# EAGLE design LipSync_Interface_Board_March_8 (EAGLE 8.5.2)
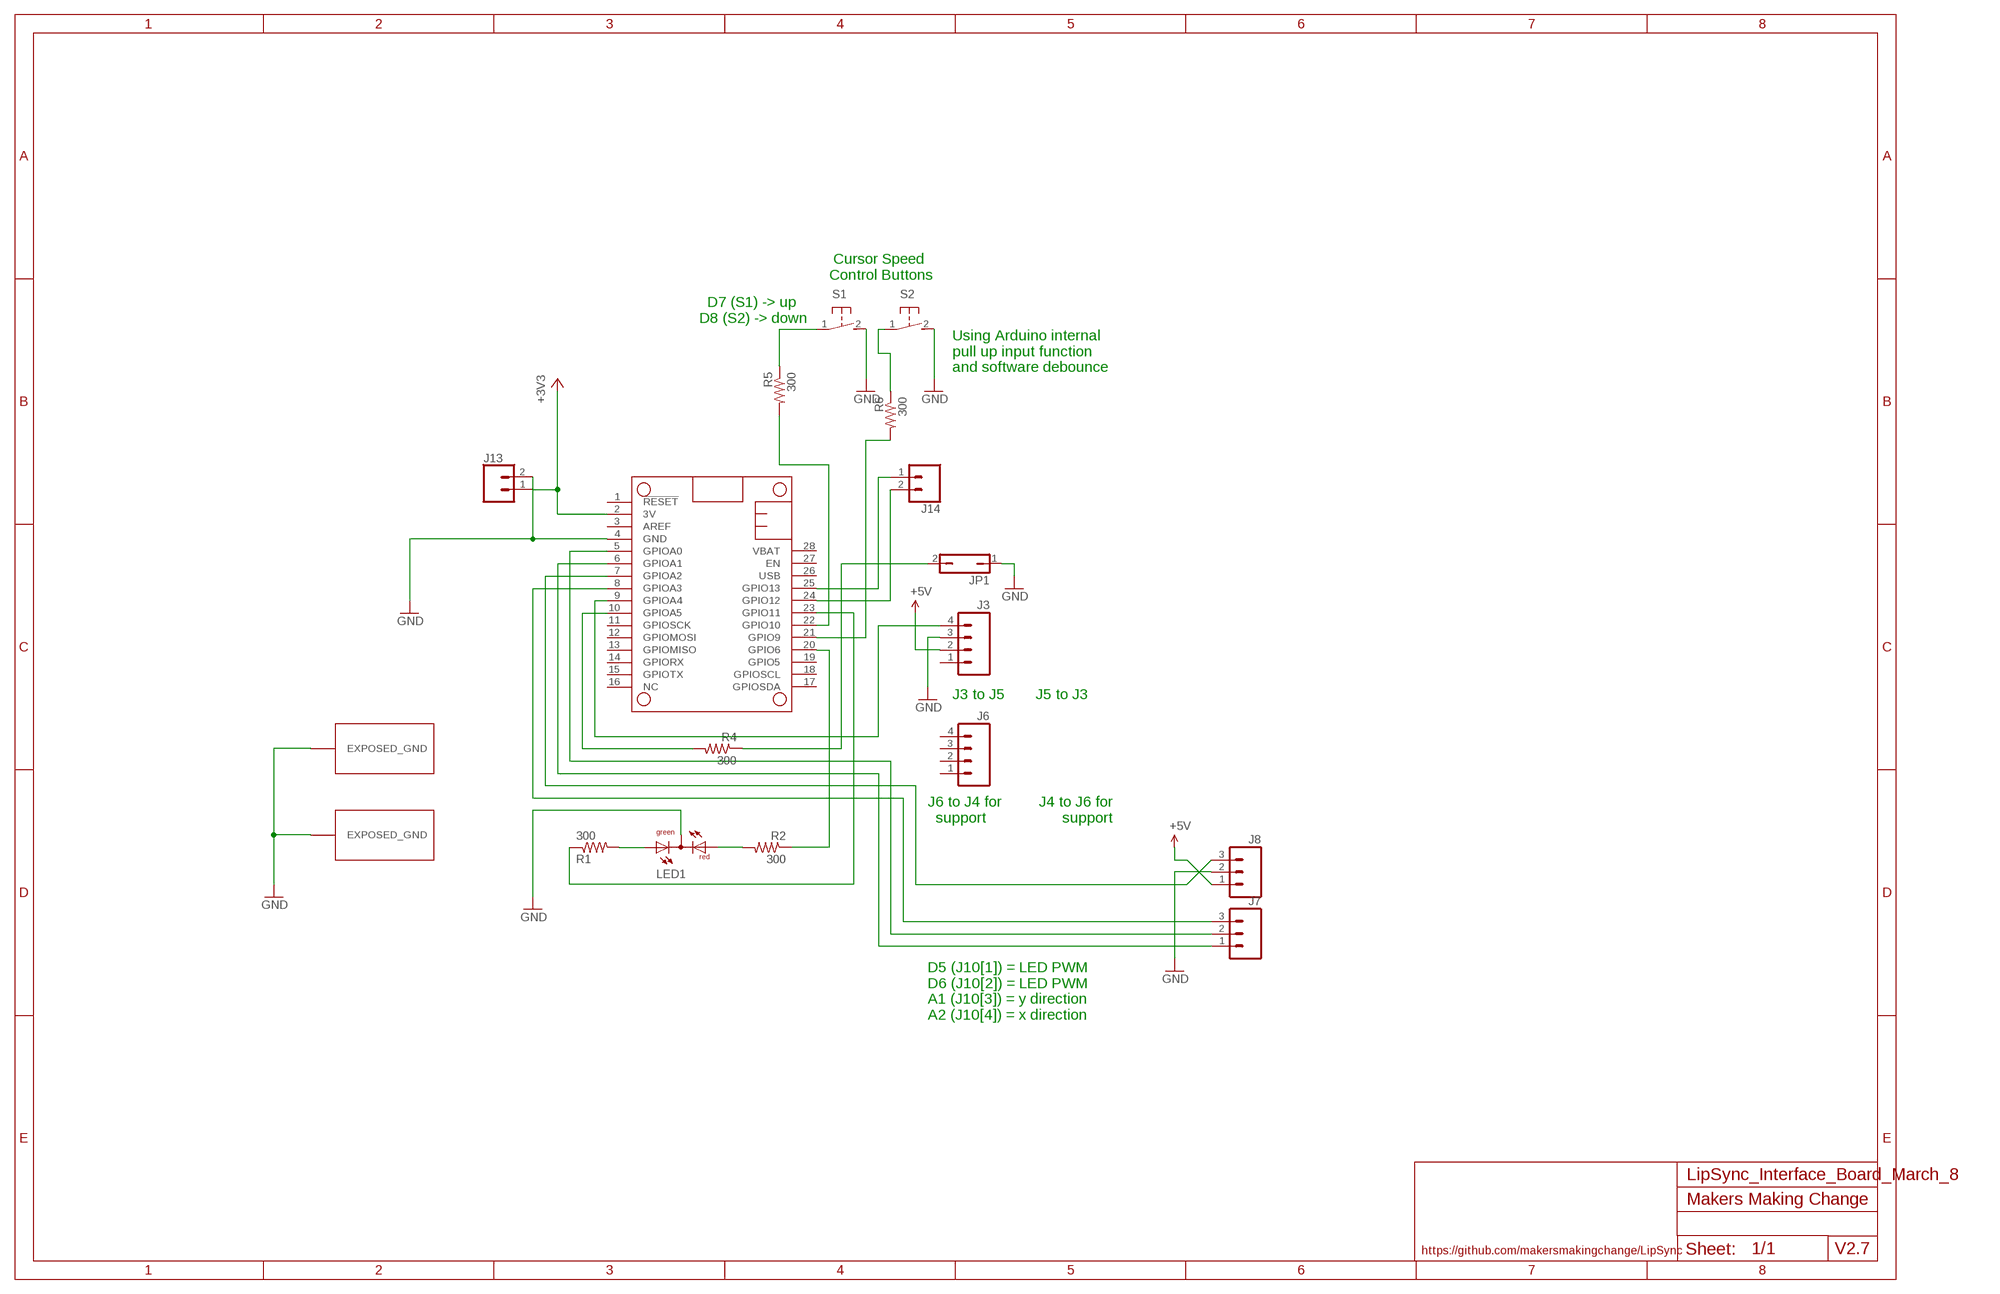
[diagram p0: schematic, sheet 1]

## Parts
J3  M04PTH  [1X04]
J6  M04PTH  [1X04]
J7  M03LOCK  [1X03_LOCK]
J8  M03LOCK  [1X03_LOCK]
J13  CONN_02  [1X02]
J14  CONN_02  [1X02]
JP1  JP1Q  [JP1]
LED1  DUOLED-RG-C  [DUOLED-C-5MM]
MS2  FEATHERWING_NODIM  [FEATHERWING_DIM]
R1  300  RESISTORAXIAL-0.3  [AXIAL-0.3]
R2  300  RESISTORAXIAL-0.3  [AXIAL-0.3]
R4  300  RESISTORAXIAL-0.3  [AXIAL-0.3]
R5  300  RESISTORAXIAL-0.3  [AXIAL-0.3]
R6  300  RESISTORAXIAL-0.3  [AXIAL-0.3]
S1  31-XXB3F-31XX-CUSTOM  [B3F-31XX-CUSTOM]
S2  31-XXB3F-31XX-CUSTOM  [B3F-31XX-CUSTOM]
U$2  EXPOSED_GND  [EXPOSED_GND]
U$3  EXPOSED_GND  [EXPOSED_GND]

## Nets
+3V3: J13.1 MS2.2(3V)
GND: J3.3 J8.2 J13.2 JP1.1 LED1.C MS2.4(GND) S1.2(S) S2.2(S) U$2.GND1(EXPOSED_GND) U$3.GND1(EXPOSED_GND)
N$1: J7.2 MS2.5(GPIOA0)
N$2: J7.1 MS2.6(GPIOA1)
N$3: J8.3 MS2.7(GPIOA2)
N$4: J7.3 MS2.8(GPIOA3)
N$5: J3.4 MS2.9(GPIOA4)
N$6: MS2.21(GPIO9) R6.P$2
N$9: MS2.20(GPIO6) R2.P$1
N$10: MS2.10(GPIOA5) R4.P$2
N$11: R5.P$1 S1.1(P)
N$12: LED1.AX(AG) R1.P$2
N$13: LED1.AR R2.P$2
N$14: JP1.2 R4.P$1
N$15: R6.P$1 S2.1(P)
N$17: J14.1 MS2.25(GPIO13)
N$18: MS2.23(GPIO11) R1.P$1
N$19: J14.2 MS2.24(GPIO12)
N$23: MS2.22(GPIO10) R5.P$2
VCC: J3.2 J8.1 ; supply symbol labelled +5V
Unconnected: J3.1 J6.1 J6.2 J6.3 J6.4 MS2.1(!RESET) MS2.3(AREF) MS2.11(GPIOSCK) MS2.12(GPIOMOSI) MS2.13(GPIOMISO) MS2.14(GPIORX) MS2.15(GPIOTX) MS2.16(NC) MS2.17(GPIOSDA) MS2.18(GPIOSCL) MS2.19(GPIO5) MS2.26(USB) MS2.27(EN) MS2.28(VBAT)

## Notes on the sheet
- Cursor Speed
  Control Buttons
- D7 (S1) -> up
  D8 (S2) -> down
- Using Arduino internal
  pull up input function
  and software debounce
- J3 to J5 | J5 to J3
- J6 to J4 for
    support
- J4 to J6 for
    support
- D5 (J10[1]) = LED PWM
  D6 (J10[2]) = LED PWM
  A1 (J10[3]) = y direction
  A2 (J10[4]) = x direction
- Makers Making Change
- https://github.com/makersmakingchange/LipSync | V2.7

## Library data of the parts
J3 J6 = SparkFun-Connectors:M04: Header 4 Standard 4-pin 0.1" header. Use with straight break away headers (SKU : PRT-00116), right angle break away headers (PRT-00553), swiss pins (PRT-00743), machine pins (PRT-00117), and female headers (PRT-00115). Molex polarized connector foot print use with SKU : PRT-08231 with associated crimp pins and housings. 1MM SMD Version SKU: PRT-10208; PROD_ID: CONN-09696
J7 J8 = SparkFun-Connectors:M03: Header 3 Standard 3-pin 0.1" header. Use with straight break away headers (SKU : PRT-00116), right angle break away headers (PRT-00553), swiss pins (PRT-00743), machine pins (PRT-00117), and female headers (PRT-00115). Molex polarized connector foot print use with SKU : PRT-08232 with associated crimp pins and housings.
J13 J14 = SparkFun-Connectors:CONN_02: Multi connection point. Often used as Generic Header-pin footprint for 0.1 inch spaced/style header connections On any of the 0.1 inch spaced packages, you can populate with these: Break Away Headers - Straight <https://www.sparkfun.com/products/116> (PRT-00116) Break Away Male Headers - Right Angle <https://www.sparkfun.com/products/553> (PRT-00553) Female Headers <https://www.sparkfun.com/products/115> (PRT-00115) Break Away Headers - Machine Pin <https://www.sparkfun.com/products/117> (PRT-00117) Break Away Female Headers - Swiss Machine Pin <https://www.sparkfun.com/products/743> (PRT-00743) For SCREWTERMINALS and SPRING TERMINALS visit here: Screw Terimnals on SparkFun.com <https://www.sparkfun.com/search/results?term=Screw+Terminals> (5mm/3.5mm/2.54mm spacing) This device is also useful as a general connection point to wire up your design to another part of your project. Our various solder wires solder well into these plated through hole pads. Hook-Up Wire - Assortment (Stranded, 22 AWG) <https://www.sparkfun.com/products/11375> (PRT-11375) Hook-Up Wire - Assortment (Solid Core, 22 AWG) <https://www.sparkfun.com/products/11367> (PRT-11367) View the entire wire category on our website here <https://www.sparkfun.com/categories/141> Special notes: Molex polarized connector foot print use with: PRT-08233 with associated crimp pins and housings. 2.54_SCREWTERM for use with PRT-10571. 3.5mm Screw Terminal footprints for PRT-08084 5mm Screw Terminal footprints for use with PRT-08432
JP1 = jumper:JP1Q: JUMPER
LED1 = led:DUOLED-RG-C: DUO LED 2 colors (red/green), 5 mm, round, common Cathode www.ligitek.com or other producers.
MS2 = adafruit:FEATHERWING
R1 R2 R4-R6 = SparkFun-Passives:RESISTOR: Resistor Basic schematic elements and footprints for 0603, 1206, and PTH resistors.
S1 S2 = switch-omron:31-XX: OMRON SWITCH
U$2 U$3 = IVAN_custom:EXPOSED_GND: Exposed copper plane to connect ground to conductive ABS housing

## Net classes
0 GND: clearance 0.205 mm
2 GND2: clearance 0.205 mm to class 0, clearance 0.205 mm to class 1, clearance 0.205 mm
3 GND3: clearance 0.205 mm to class 0, clearance 0.205 mm to class 1, clearance 0.205 mm to class 2, clearance 0.205 mm

## Board
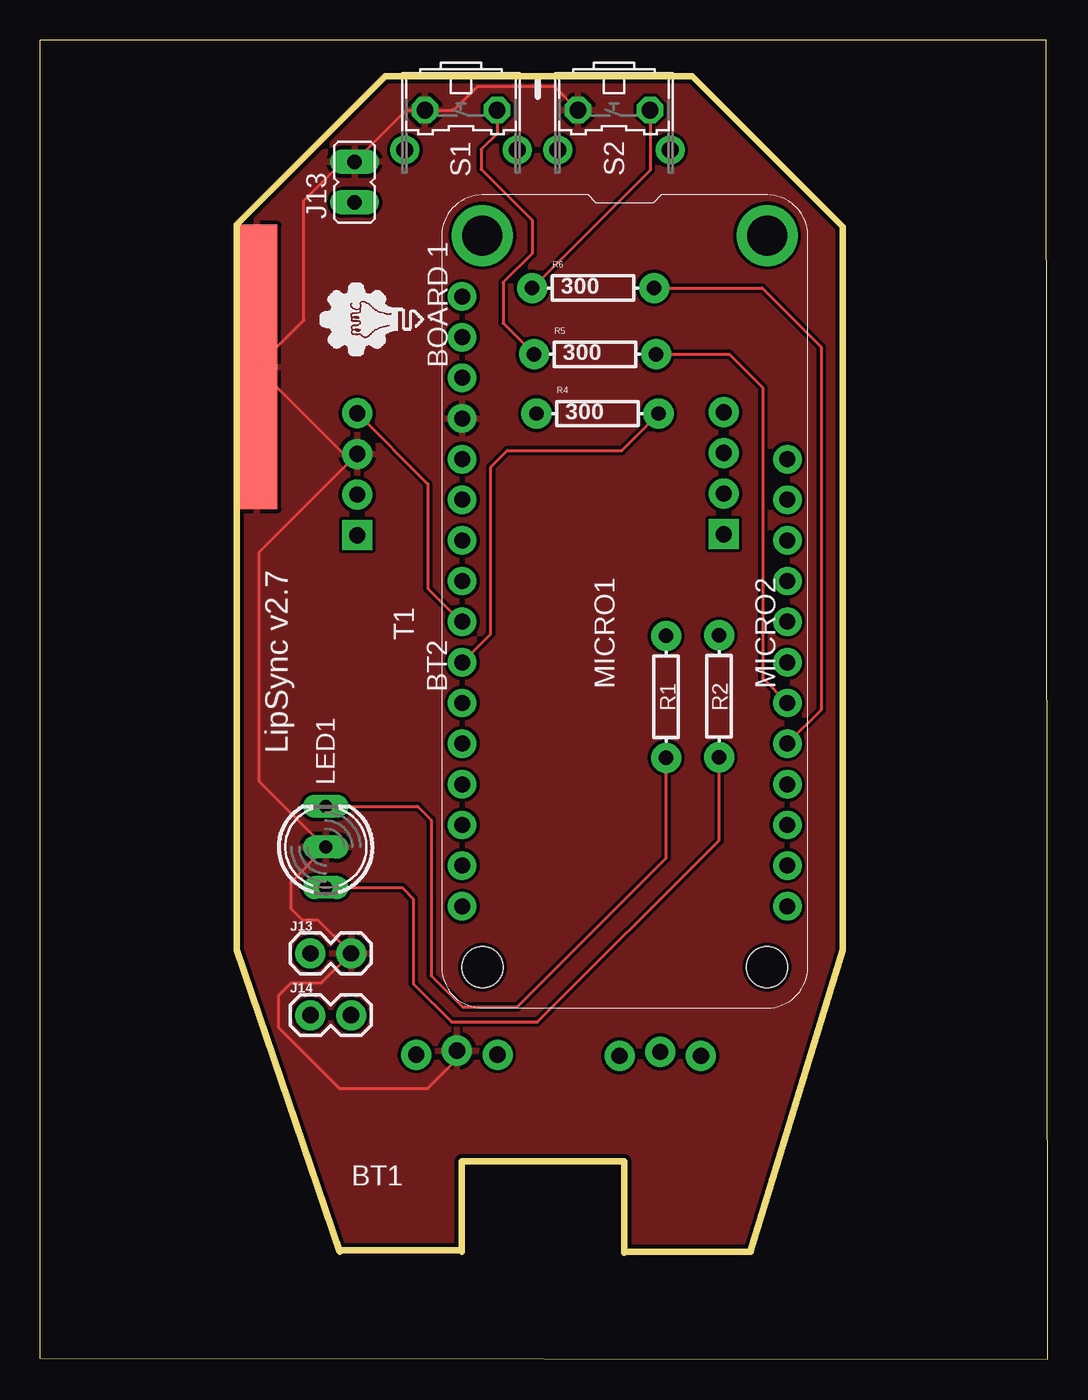
[diagram p1: board, top side]
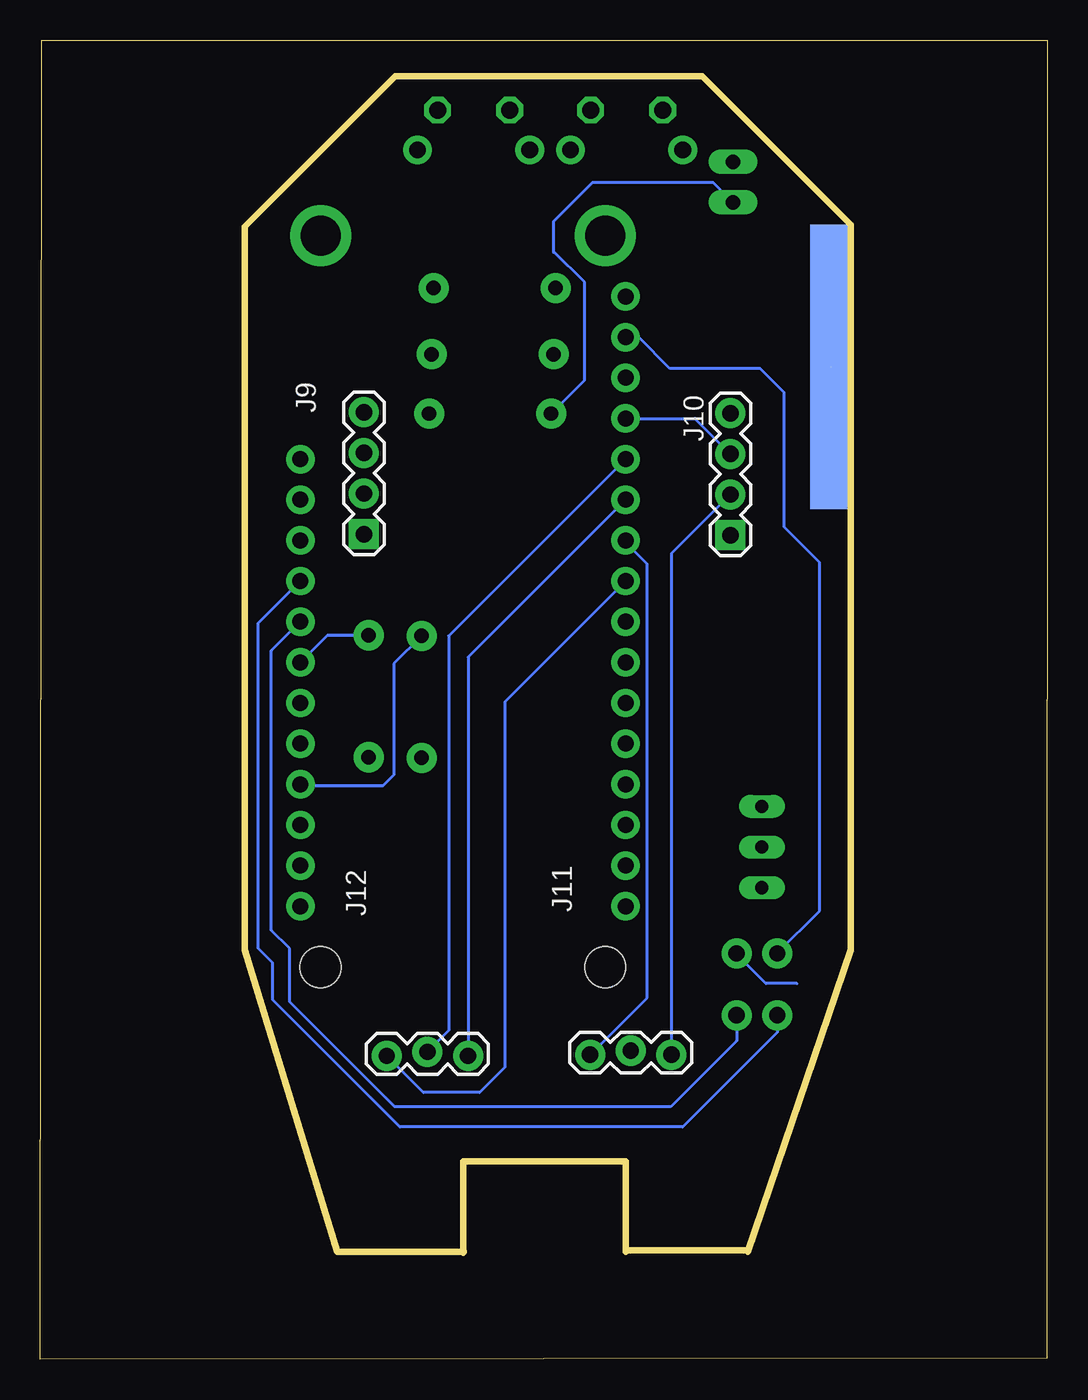
[diagram p2: board, bottom side, seen from below]

Size 62.94 x 82.45 mm. Coordinates in mm from the lower left corner, seen from the top.
Outline: 18.72,6.73 12.29,25.58 12.29,70.92 21.57,80.19 40.74,80.19 50.14,70.79 50.14,25.58 44.37,6.73
Outline: 26.34,6.72 26.34,12.39 36.5,12.39 36.5,6.67
Outline: 26.33,6.82 18.73,6.82 18.73,6.72
Outline: 44.38,6.72 36.48,6.72 36.48,6.77
Outline: 0.02,0.08 62.94,0 62.84,82.42 0,82.45 0.02,0.08
Copper layers (1*16): Top 0.035mm / dielectric 1.5mm / Bottom 0.035mm
Design rules "SparkFun *": minimum track width 7mil, minimum drill 20mil, track to track 8mil, track to pad 8mil, pad to pad 8mil, via to via 8mil, smd to smd 8mil, copper to edge 10mil, drill to drill 8mil, minimum pad ring 12mil, minimum via ring 10mil, stop-mask expansion 4mil, vias tented up to drill 25mil, thermal gap 10mil

### Footprints (pad centres in the part's own frame; a part is rotated, then mirrored left to right if it is on the bottom)
1X04 = drill 1.016 pad 1.88 square: 1 0,0 | drill 1.016 pad 1.88: 2 2.54,0; 3 5.08,0; 4 7.62,0
1X03_LOCK = drill 1.016 pad 1.88: 1 0,0.127; 2 2.54,-0.127; 3 5.08,0.127
1X02 = drill 1.016 pad 1.88: 1 0,0; 2 2.54,0
JP1 = drill 0.914 long: 1 0,-1.27; 2 0,1.27
DUOLED-C-5MM = drill 0.813 long: AR 2.54,0; AX -2.54,0; C 0,0
FEATHERWING_DIM = drill 1 pad 1.778: 1 6.35,1.27; 2 8.89,1.27; 3 11.43,1.27; 4 13.97,1.27; 5 16.51,1.27; 6 19.05,1.27; 7 21.59,1.27; 8 24.13,1.27; 9 26.67,1.27; 10 29.21,1.27; 11 31.75,1.27; 12 34.29,1.27; 13 36.83,1.27; 14 39.37,1.27; 15 41.91,1.27; 16 44.45,1.27; 17 44.45,21.59; 18 41.91,21.59; 19 39.37,21.59; 20 36.83,21.59; 21 34.29,21.59; 22 31.75,21.59; 23 29.21,21.59; 24 26.67,21.59; 25 24.13,21.59; 26 21.59,21.59; 27 19.05,21.59; 28 16.51,21.59 | drill 2.5 pad 3.81: P$1 2.54,20.32; P$2 2.54,2.54 | hole 2.54: 48.26,20.32; 48.26,2.54
AXIAL-0.3 = drill 0.9 pad 1.88: P$1 -3.81,0; P$2 3.81,0
B3F-31XX-CUSTOM = drill 1.05 pad 1.6 octagon: 1 -2.25,-1.245; 2 2.25,-1.245 | drill 1.05 pad 1.8: 3 -3.505,1.245; 4 3.505,1.245
EXPOSED_GND = smd 2.54 x 17.78: GND1 0,0

### Placement (x,y rotation side)
J3  19.82,51.51 90 bottom
J6  42.71,51.57 90 bottom
J7  36.2,19.1 180 bottom
J8  23.5,19.17 180 bottom
J13  16.89,25.37 0 top
J14  16.89,21.51 0 top
JP1  19.65,73.57 180 top
LED1  17.85,32.02 90 top
MS2  25.1,72.77 270 top
R1  42.42,41.44 270 top
R2  39.11,41.4 270 top
R4  34.82,59.11 0 top
R5  34.67,62.81 0 top
R6  34.54,66.95 0 top
S1  26.3,76.82 180 top
S2  35.85,76.82 180 top
U$2  13.55,62.02 0 top
U$3  13.55,62.02 0 bottom

### Tracks (layer width: path | path; a pad name or v marks a point on that pad's centre or on a via)
+3V3
  Bottom 0.178: J13.1 16.89,25.4 14.25,28.04 14.25,49.81 16.46,52.02 16.46,60.43 17.96,61.93 23.6,61.93 25.55,63.88 MS2.2
GND  (1 unrouted)
  Top 0.178: S2.2 32.12,79.55 27.33,79.55 25.84,78.07 S1.2 22.88,78.07 JP1.1 18.91,74.84 | 18.78,74.84 18.91,74.84 | 18.91,74.84 16.48,72.42 16.48,64.95 U$3.GND1 18.98,56.59 J3.3 13.67,50.43 13.67,36.14 17.79,32.02 LED1.C 15.65,29.82 15.65,28.19 16.38,27.46 17.35,27.46 J13.2 17.58,23.52 15.7,23.52 14.88,22.71 14.88,20.74 18.68,16.94 24.23,16.94 26.04,18.75 J8.2
  Bottom 0.178: 15.67,23.5 17.6,23.5 19.43,25.32 J13.2 | MS2.4 22.03,58.8 J3.3
  pour Top: 12.29,70.92 21.56,80.19 40.74,80.19 50.14,70.79 50.14,25.58 44.37,6.73 18.72,6.73 12.29,25.58
N$1
  Bottom 0.178: MS2.5 37.41,45.21 37.41,20.55 J7.2
N$2
  Bottom 0.178: MS2.6 36.2,43.89 J7.1
N$3
  Bottom 0.178: J8.3 25.02,22.61 25.02,49.71 26.37,51.05 MS2.7
N$4
  Bottom 0.178: MS2.8 33.91,41.1 33.91,18.26 35.48,16.69 39,16.69 J7.3
N$5
  Top 0.178: J3.4 24.23,54.71 24.23,48.16 26.29,46.1 MS2.9
N$6
  Top 0.178: R6.P$2 45.11,66.95 48.79,63.27 48.79,40.59 MS2.21
N$9
  Bottom 0.178: R2.P$1 40.84,43.48 40.84,36.53 41.53,35.84 46.58,35.84 MS2.20
N$10
  Top 0.178: R4.P$2 36.32,56.79 29.19,56.79 28.14,55.75 28.14,45.34 MS2.10
N$11
  Top 0.178: S1.1 28.55,76.6 27.56,75.62 27.56,74.37 30.73,71.2 30.73,69.11 28.93,67.31 28.93,64.74 R5.P$1
N$12
  Top 0.178: LED1.AX 22.61,29.48 23.32,28.78 23.32,23.47 25.71,21.08 31.06,21.08 42.42,32.43 R1.P$2
N$13
  Top 0.178: LED1.AR 23.58,34.56 24.43,33.71 24.43,23.98 26.39,22.02 29.79,22.02 39.11,31.34 R2.P$2
N$14
  Bottom 0.178: R4.P$1 28.93,61.19 28.93,67.31 30.81,69.19 30.86,69.19 30.86,71.12 28.42,73.56 20.91,73.56 JP1.2
N$15
  Top 0.178: S2.1 38.1,74.32 R6.P$1
N$17
  Bottom 0.178: J14.1 16.89,20.45 22.81,14.53 40.46,14.53 48.41,22.48 48.41,24.79 49.3,25.68 49.3,46.03 MS2.25
N$18
  Bottom 0.178: R1.P$1 44.99,45.25 MS2.23
N$19
  Bottom 0.178: J14.2 19.43,19.91 23.55,15.8 40.79,15.8 47.35,22.35 47.35,25.68 48.49,26.82 48.49,44.3 MS2.24
N$23
  Top 0.178: R5.P$2 43.05,62.81 45.14,60.73 45.14,42.57 MS2.22
VCC
  Bottom 0.178: J3.2 23.5,50.36 J8.1

### Text on the board
tNames: S1 | S2 | J13 | BOARD 1 | T1 | BT2 | MICRO1 | MICRO2 | R1 | R2 | LipSync v2.7 | LED1 | BT1
bNames: J9 | J10 | J11 | J12